# Altium schematic sheet Sheet1.SchDoc
size A4
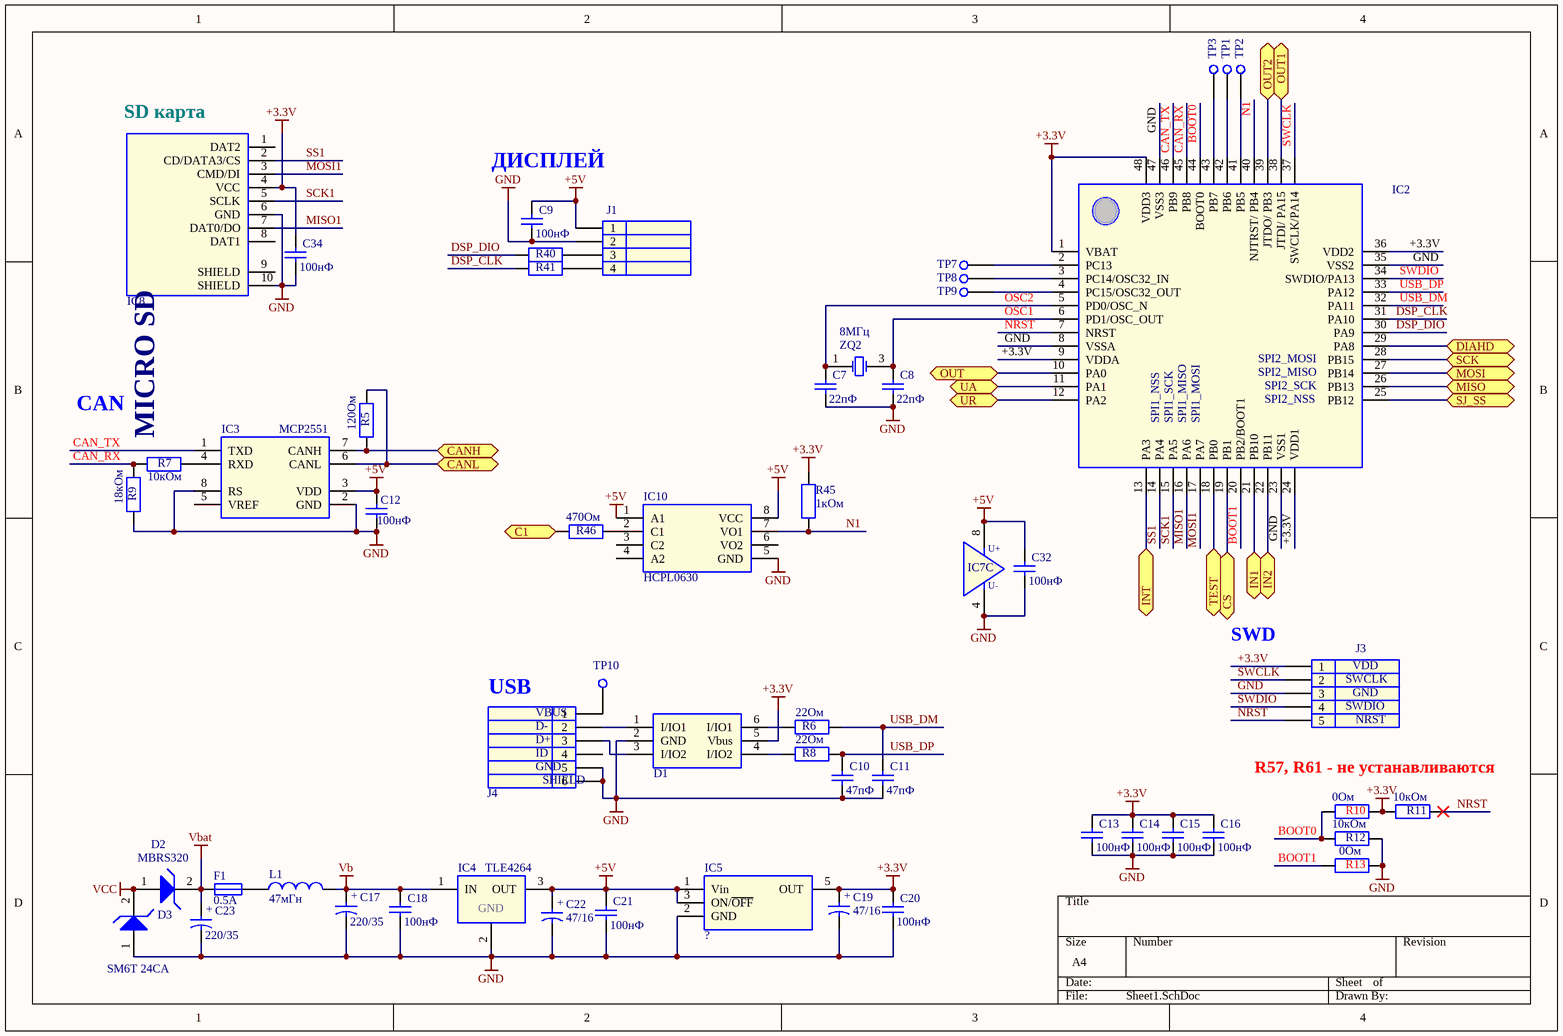
[diagram p0: Sheet1.SchDoc]

## Parts
C7  value 22пФ  [0603]  (hidden comment: Cap)
C8  value 22пФ  [0603]  (hidden comment: Cap)
C9  value 100нФ  [0603]  (hidden comment: Cap)
C10  value 47пФ  [0603]  (hidden comment: Cap)
C11  value 47пФ  [0603]  (hidden comment: Cap)
C12  value 100нФ  [0603]  (hidden comment: Cap)
C13  value 100нФ  [0603]  (hidden comment: Cap)
C14  value 100нФ  [0603]  (hidden comment: Cap)
C15  value 100нФ  [0603]  (hidden comment: Cap)
C16  value 100нФ  [0603]  (hidden comment: Cap)
C17  value 220/35  [SMD 8x10.5]  (hidden comment: Cap2)
C18  value 100нФ  [0603]  (hidden comment: Cap)
C19  value 47/16  [SMD 6.3x5.4]  (hidden comment: Cap2)
C20  value 100нФ  [0603]  (hidden comment: Cap)
C21  value 100нФ  [0603]  (hidden comment: Cap)
C22  value 47/16  [SMD 6.3x5.4]  (hidden comment: Cap2)
C23  value 220/35  [SMD 8x10.5]  (hidden comment: Cap2)
C32  value 100нФ  [0603]  (hidden comment: Cap)
C34  value 100нФ  [0603]  (hidden comment: Cap)
D1  USBLC6-2  [SOT23-6]  (value not drawn)
D2  value MBRS320  [DO-214AB]  (hidden comment: ZENER)
D3  value SM6T 24CA  [DO-214AA]  (hidden comment: ZENER)
F1  value 0.5A  [1812Fuse]  (hidden comment: FUSE)
IC2  STM32F10x_LQFP48  [LQFP48-0.5]  (value not drawn)
IC3  MCP2551  [SO-8]
IC4  value TLE4264  [SOT223]  (hidden comment: SOT223)
IC5  LP2980  [SOT23-5]  (value not drawn)
IC7  LM258  [SO-8]  (value not drawn)  (part C of 3)
IC8  MICRO_SD_SLOT  [MICRO SD CARD 2]  (value not drawn)
IC10  HCPL0630  [SO-8]
J1  s-4  [CWF-4R]  (value not drawn)
J3  s-5  [PLS-5]  (value not drawn)
J4  USB micro-BF  [USB micro B]  (value not drawn)
L1  value 47мГн  [LQH32C]  (hidden comment: Inductor)
R5  value 120Ом  [0603]  (hidden comment: Res)
R6  value 22Ом  [0603]  (hidden comment: Res)
R7  value 10кОм  [0603]  (hidden comment: Res)
R8  value 22Ом  [0603]  (hidden comment: Res)
R9  value 18кОм  [0603]  (hidden comment: Res)
R10  value 0Ом  [0603]  (hidden comment: Res)
R11  value 10кОм  [0603]  (hidden comment: Res)
R12  value 10кОм  [0603]  (hidden comment: Res)
R13  value 0Ом  [0603]  (hidden comment: Res)
R40  Res  [0603]  (value not drawn)
R41  Res  [0603]  (value not drawn)
R45  value 1кОм  [0603]  (hidden comment: Res)
R46  value 470Ом  [0603]  (hidden comment: Res)
TP1  TP  [PAD_R1]  (value not drawn)
TP2  TP  [PAD_R1]  (value not drawn)
TP3  TP  [PAD_R1]  (value not drawn)
TP7  TP  [PAD_R1]  (value not drawn)
TP8  TP  [PAD_R1]  (value not drawn)
TP9  TP  [PAD_R1]  (value not drawn)
TP10  TP  [PAD_R1]  (value not drawn)
ZQ2  value 8МГц  [KX-9A]  (hidden comment: QUARTZ_2)

## Ports
C1, CANH, CANL, CS, DIAHD, IN1, IN2, INT, MISO, MOSI, OUT, OUT1, OUT2, SCK, SJ_SS, TEST, UA, UR

## Nets
+3.3V: C13.2 C14.2 C15.2 C16.2 C19.1 C20.2 C34.2 D1.5(Vbus) IC2.1(VBAT) IC2.9(VDDA) IC2.24(VDD1) IC2.36(VDD2) IC2.48(VDD3) IC5.5(OUT) IC8.4(VCC) J3.1 R10.2 R11.1 R45.1
+5V: C9.2 C12.2 C21.2 C22.1 C32.2 IC3.3(VDD) IC4.3(OUT) IC5.1(Vin) IC5.3(ON/~{OFF}) IC7.8(+U) IC10.1(A1) IC10.8(VCC) J1.1
GND: C7.1 C8.1 C9.1 C10.1 C11.1 C12.1 C13.1 C14.1 C15.1 C16.1 C17.2 C18.1 C19.2 C20.1 C21.1 C22.2 C23.2 C32.1 C34.1 D1.2(GND) D3.1(A) IC2.8(VSSA) IC2.23(VSS1) IC2.35(VSS2) IC2.47(VSS3) IC3.2(GND) IC3.8(RS) IC4.2(GND) IC5.2(GND) IC7.4(U-) IC8.6(GND) IC8.10(SHIELD) IC10.5(GND) J1.2 J3.3 J4.5 J4.6 R9.1 R12.2 R13.2
Vb: C17.1 C18.2 IC4.1(IN) L1.2
Vbat: C23.1 D2.2(K) F1.1
VCC: D2.1(A) D3.2(K)
BOOT0: IC2.44(BOOT0) R10.1 R12.1
BOOT1: IC2.20(PB2/BOOT1) R13.1
C1: R46.2 ; port C1
CAN_RX: IC2.45(PB8) R7.1 R9.2
CAN_TX: IC2.46(PB9) IC3.1(TXD)
CANH: IC3.7(CANH) R5.1 ; port CANH
CANL: IC3.6(CANL) R5.2 ; port CANL
CS: IC2.19(PB1) ; port CS
DIAHD: IC2.29(PA8) ; port DIAHD
DSP_CLK: IC2.31(PA10) R41.2
DSP_DIO: IC2.30(PA9) R40.2
IN1: IC2.21(PB10) ; port IN1
IN2: IC2.22(PB11) ; port IN2
INT: IC2.13(PA3) ; port INT
MISO: IC2.26(PB13) ; port MISO
MISO1: IC2.16(PA6) IC8.7(DAT0/DO)
MOSI: IC2.27(PB14) ; port MOSI
MOSI1: IC2.17(PA7) IC8.3(CMD/DI)
N1: IC2.40(NJTRST/_PB4) IC10.7(VO1) R45.2
NRST: IC2.7(NRST) J3.5 R11.2
OSC1: C8.2 IC2.6(PD1/OSC_OUT) ZQ2.3(OSC2)
OSC2: C7.2 IC2.5(PD0/OSC_N) ZQ2.1(OSC1)
OUT: IC2.10(PA0) ; port OUT
OUT1: IC2.38(JTDI/_PA15) ; port OUT1
OUT2: IC2.39(JTDO/_PB3) ; port OUT2
SCK: IC2.28(PB15) ; port SCK
SCK1: IC2.15(PA5) IC8.5(SCLK)
SJ_SS: IC2.25(PB12) ; port SJ_SS
SS1: IC2.14(PA4) IC8.2(CD/DATA3/CS)
SWCLK: IC2.37(SWCLK/PA14) J3.2
SWDIO: IC2.34(SWDIO/PA13) J3.4
TEST: IC2.18(PB0) ; port TEST
UA: IC2.11(PA1) ; port UA
UR: IC2.12(PA2) ; port UR
USB_DM: C11.2 IC2.32(PA11) R6.1
USB_DP: C10.2 IC2.33(PA12) R8.1
NetD1_1: D1.1(I/IO1) J4.2
NetD1_3: D1.3(I/IO2) J4.3
NetD1_4: D1.4(I/IO2) R8.2
NetD1_6: D1.6(I/IO1) R6.2
NetF1_2: F1.2 L1.1
NetIC2_2: IC2.2(PC13) TP7.1
NetIC2_3: IC2.3(PC14/OSC32_IN) TP8.1
NetIC2_4: IC2.4(PC15/OSC32_OUT) TP9.1
NetIC2_41: IC2.41(PB5) TP2.1
NetIC2_42: IC2.42(PB6) TP1.1
NetIC2_43: IC2.43(PB7) TP3.1
NetIC3_4: IC3.4(RXD) R7.2
NetIC10_2: IC10.2(C1) R46.1
NetJ1_3: J1.3 R40.1
NetJ1_4: J1.4 R41.1
NetJ4_1: J4.1 TP10.1

Not connected (* = marked no-connect by the designer): IC3 5(VREF); IC8 1(DAT2) 8(DAT1) 9(SHIELD); IC10 3(C2) 4(A2) 6(VO2); J4 4

## Notes on the sheet
- (near IC8) SD карта
- ДИСПЛЕЙ
- (near IC2) SPI2_MOSI
- (near IC2) SPI2_MISO
- CAN
- (near IC2) SPI1_NSS
- (near IC2) SPI1_SCK
- (near IC2) SPI1_MISO
- (near IC2) SPI1_MOSI
- (near IC2) SPI2_SCK
- (near IC2) SPI2_NSS
- SWD
- USB
- (near J3) SWCLK
- (near J3) SWDIO
- (near J3) VDD
- (near J3) GND
- R57, R61 - не устанавливаются
- (near J3) NRST
- (in symbol Cap2) +
- (in symbol LM258, part C) U+
- (in symbol MICRO_SD_SLOT) MICRO SD
- (in symbol USB micro-BF) VBUS; D-; D+; ID; GND; SHIELD

## Library data of the parts
C7 C8 = Cap: Capacitor; Order: 22пФ 10% 50В 0805; Group: Конденсаторы; Function: Конденсатор неполярный; Manufacturer: ?; Case: ?
C9 C12-C16 C18 C20 C21 C32 C34 = Cap: Capacitor; Order: 100нФ 10% 50В 0805; Group: Конденсаторы; Function: Конденсатор неполярный; Manufacturer: ?; Case: ?
C10 C11 = Cap: Capacitor; Order: 47пФ 10% 50В 0805; Group: Конденсаторы; Function: Конденсатор неполярный; Manufacturer: ?; Case: ?
C17 C19 C22 C23 = Cap2: Capacitor; Group: Конденсаторы; Function: Конденсатор полярный; Manufacturer: ?
  C17 C23: Order: 220/35; Case: SMD 8x10.5
  C19 C22: Order: 47/16; Case: ?
D1 = USBLC6-2: Group: Диоды; Function: Very low capacitance ESD protection; Order: USBLC6-2; Value: USBLC6-2; Manufacturer: ?; Case: ?
D2 D3 = ZENER: Group: Диоды; Function: Zener диод; Manufacturer: ?
  D2: Order: MBRS320; Case: DO-214AB
  D3: Order: SM6T 24CA; Case: DO-214AA
F1 = FUSE: Resistor; Group: Разное; Order: 0.5A; Manufacturer: ?; Function: ?; Case: 1812Fuse
IC2 = STM32F10x_LQFP48: Manufactirer: STM; Group: Микросхемы; Function: MCU; Value: STM32F10x; Order: STM32F10x; Case: LQFP48-0.5
IC3 = MCP2551: Manufacturer: Microchip; Order: MCP2551T-I/SN; Function: CAN передатчик; Order: Микросхемы; Case: SO-8; Value: MCP2551
IC4 = TLE4264: Manufacturer: infineon; Group: Микросхемы; Function: Стабилизатор; Order: TLE4264; Case: SOT223
IC5 = LP2980: Order: LP2980IM5-3.3; Value: ?
IC7 = LM258: Manufacturer: Texas Instruments; Group: Микросхемы; Order: LM258D; Function: ОУ; Value: LM258; Case: SO-8
IC8 = MICRO_SD_SLOT: Value: micro SD; Group: Разъемы; Function: Разъем для microSD карт; Case: ?; Order: micro SD; Manufacturer: ?
IC10 = HCPL0630: Manufacturer: Fairchild Semiconductor; Function: Развязка с лог. выходом; Group: Микросхемы; Order: HCPL0630; Case: SO-8; Value: HCPL0630
J1 = s-4: Group: Разъемы; Order: CWF-4R; Value: ?; Manufacturer: ?; Function: ?; Case: ?
J4 = USB micro-BF: Value: USB micro B; Case: ?; Order: USB micro B
L1 = Inductor: Group: Индуктивности; Function: Индуктивность; Order: 47мГн; Case: LQH32C; Manufacturer: ?
R5 = Res: Resistor; Order: 120Ом 5% 0805; Group: Резисторы; Function: Резистор постоянный; Case: ?; Manufacturer: ?
R6 R8 = Res: Resistor; Order: 22Ом 5% 0805; Group: Резисторы; Function: Резистор постоянный; Case: ?; Manufacturer: ?
R7 R11 R12 = Res: Resistor; Order: 10кОм 5% 0805; Group: Резисторы; Function: Резистор постоянный; Case: ?; Manufacturer: ?
R9 = Res: Resistor; Order: 18кОм 5% 0805; Group: Резисторы; Function: Резистор постоянный; Case: ?; Manufacturer: ?
R10 R13 = Res: Resistor; Order: 0Ом 5% 0805; Group: Резисторы; Function: Резистор постоянный; Case: ?; Manufacturer: ?
R40 R41 = Res: Resistor; Order: 100Ом 5% 0805; Group: Резисторы; Function: Резистор постоянный; Value: 100Ом; Case: ?; Manufacturer: ?
R45 = Res: Resistor; Order: 1кОм 5% 0805; Group: Резисторы; Function: Резистор постоянный; Case: ?; Manufacturer: ?
R46 = Res: Resistor; Order: 470Ом 5% 0805; Group: Резисторы; Function: Резистор постоянный; Case: ?; Manufacturer: ?
TP1-TP3 TP7-TP10 = TP: Group: Не устанавливается; Value: tp; Order: tp; Manufactirer: ?; Function: ?; Case: ?
ZQ2 = KX-9A: Crystal Oscillator; Manufacturer: Кварцевый резонатор; Group: Резонаторы; Order: 8МГц; Case: KX-9A; Function: Crystal Oscillator
J3 = s-5: Order: PLS-5; Value: ?